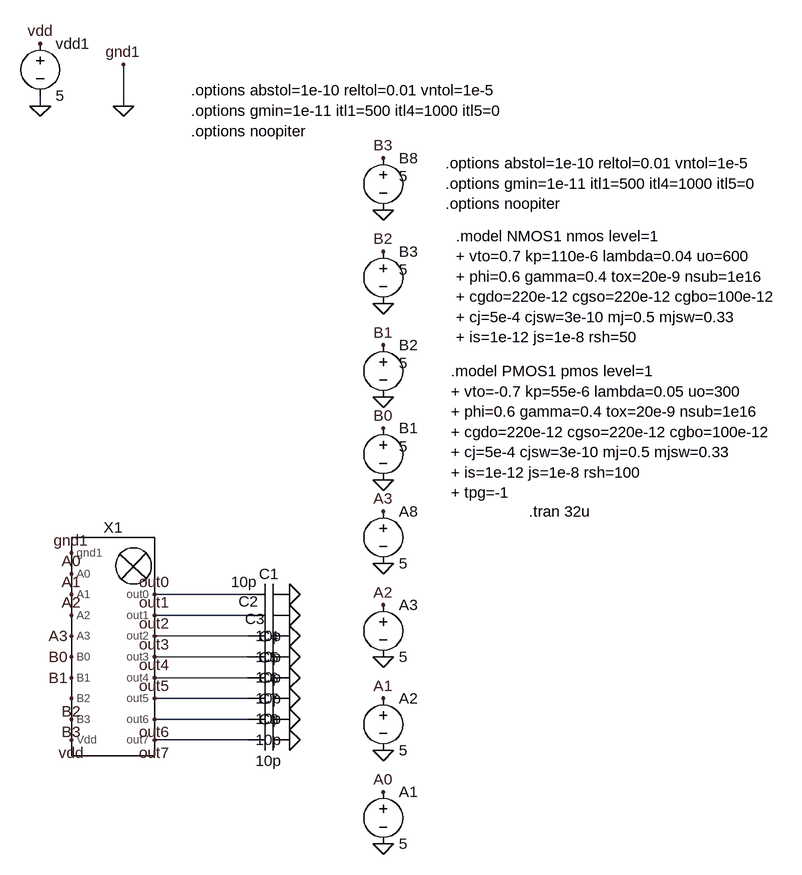
[diagram p0: schematic mult1_tb.asc]
mult1_tb.asc, the LTspice schematic file:
Version 4.1
SHEET 1 1016 740
WIRE -176 -496 -176 -512
WIRE -48 -496 -48 -560
WIRE 144 256 0 256
WIRE 144 288 0 288
WIRE 144 320 0 320
WIRE 144 352 0 352
WIRE 144 384 0 384
WIRE 144 416 0 416
WIRE 144 448 0 448
WIRE 144 480 0 480
FLAG -176 -496 0
FLAG -176 -592 vdd
FLAG -48 -496 0
FLAG -48 -560 gnd1
FLAG -128 192 gnd1
FLAG -128 480 vdd
FLAG -128 224 A0
FLAG -128 256 A1
FLAG -128 288 A2
FLAG -128 320 A3
FLAG -128 352 B0
FLAG -128 384 B1
FLAG -128 416 B2
FLAG -128 448 B3
FLAG 0 256 out0
FLAG 0 288 out1
FLAG 0 320 out2
FLAG 0 352 out3
FLAG 0 384 out4
FLAG 0 416 out5
FLAG 0 448 out6
FLAG 0 480 out7
FLAG 208 256 0
FLAG 208 288 0
FLAG 208 320 0
FLAG 208 352 0
FLAG 208 384 0
FLAG 208 416 0
FLAG 208 448 0
FLAG 208 480 0
FLAG 352 -336 0
FLAG 352 -48 0
FLAG 352 80 0
FLAG 352 208 0
FLAG 352 352 0
FLAG 352 496 0
FLAG 352 640 0
FLAG 352 560 A0
FLAG 352 416 A1
FLAG 352 272 A2
FLAG 352 128 A3
FLAG 352 0 B0
FLAG 352 -128 B1
FLAG 352 -272 B2
FLAG 352 -416 B3
FLAG 352 -192 0
SYMBOL mult1 -64 336 R0
SYMATTR InstName X1
SYMBOL voltage -176 -608 R0
SYMATTR InstName vdd1
SYMATTR Value 5
SYMBOL cap 208 240 R90
WINDOW 0 0 32 VBottom 2
WINDOW 3 -19 70 VTop 2
SYMATTR InstName C1
SYMATTR Value 10p
SYMBOL cap 208 272 R90
WINDOW 0 10 63 VBottom 2
WINDOW 3 32 32 VTop 2
SYMATTR InstName C2
SYMATTR Value 10p
SYMBOL cap 208 304 R90
WINDOW 0 5 53 VBottom 2
WINDOW 3 32 32 VTop 2
SYMATTR InstName C3
SYMATTR Value 10p
SYMBOL cap 208 336 R90
WINDOW 0 0 32 VBottom 2
WINDOW 3 32 32 VTop 2
SYMATTR InstName C4
SYMATTR Value 10p
SYMBOL cap 208 368 R90
WINDOW 0 0 32 VBottom 2
WINDOW 3 32 32 VTop 2
SYMATTR InstName C5
SYMATTR Value 10p
SYMBOL cap 208 400 R90
WINDOW 0 0 32 VBottom 2
WINDOW 3 32 32 VTop 2
SYMATTR InstName C6
SYMATTR Value 10p
SYMBOL cap 208 432 R90
WINDOW 0 0 32 VBottom 2
WINDOW 3 32 32 VTop 2
SYMATTR InstName C7
SYMATTR Value 10p
SYMBOL cap 208 464 R90
WINDOW 0 0 32 VBottom 2
WINDOW 3 32 32 VTop 2
SYMATTR InstName C8
SYMATTR Value 10p
SYMBOL voltage 352 544 R0
WINDOW 123 0 0 Left 0
WINDOW 39 0 0 Left 0
SYMATTR InstName A1
SYMATTR Value 5
SYMBOL voltage 352 400 R0
WINDOW 123 0 0 Left 0
WINDOW 39 0 0 Left 0
SYMATTR InstName A2
SYMATTR Value 5
SYMBOL voltage 352 256 R0
WINDOW 123 0 0 Left 0
WINDOW 39 0 0 Left 0
SYMATTR InstName A3
SYMATTR Value 5
SYMBOL voltage 352 112 R0
WINDOW 123 0 0 Left 0
WINDOW 39 0 0 Left 0
SYMATTR InstName A8
SYMATTR Value 5
SYMBOL voltage 352 -16 R0
WINDOW 3 24 44 Left 2
WINDOW 123 0 0 Left 0
WINDOW 39 0 0 Left 0
SYMATTR Value 5
SYMATTR InstName B1
SYMBOL voltage 352 -144 R0
WINDOW 3 24 44 Left 2
WINDOW 123 0 0 Left 0
WINDOW 39 0 0 Left 0
SYMATTR Value 5
SYMATTR InstName B2
SYMBOL voltage 352 -288 R0
WINDOW 3 24 44 Left 2
WINDOW 123 0 0 Left 0
WINDOW 39 0 0 Left 0
SYMATTR Value 5
SYMATTR InstName B3
SYMBOL voltage 352 -432 R0
WINDOW 3 24 44 Left 2
WINDOW 123 0 0 Left 0
WINDOW 39 0 0 Left 0
SYMATTR Value 5
SYMATTR InstName B8
TEXT 56 -520 Left 2 !.options abstol=1e-10 reltol=0.01 vntol=1e-5\n.options gmin=1e-11 itl1=500 itl4=1000 itl5=0\n.options noopiter
TEXT 464 -296 Left 2 !.model NMOS1 nmos level=1\n+ vto=0.7 kp=110e-6 lambda=0.04 uo=600\n+ phi=0.6 gamma=0.4 tox=20e-9 nsub=1e16\n+ cgdo=220e-12 cgso=220e-12 cgbo=100e-12\n+ cj=5e-4 cjsw=3e-10 mj=0.5 mjsw=0.33\n+ is=1e-12 js=1e-8 rsh=50
TEXT 456 -88 Left 2 !.model PMOS1 pmos level=1\n+ vto=-0.7 kp=55e-6 lambda=0.05 uo=300\n+ phi=0.6 gamma=0.4 tox=20e-9 nsub=1e16\n+ cgdo=220e-12 cgso=220e-12 cgbo=100e-12\n+ cj=5e-4 cjsw=3e-10 mj=0.5 mjsw=0.33\n+ is=1e-12 js=1e-8 rsh=100\n+ tpg=-1
TEXT 576 128 Left 2 !.tran 32u
TEXT 448 -408 Left 2 !.options abstol=1e-10 reltol=0.01 vntol=1e-5\n.options gmin=1e-11 itl1=500 itl4=1000 itl5=0\n.options noopiter

The netlist it stands for:
* mult1_tb.asc
X§X1 A0 A1 A2 A3 B0 B1 B2 B3 0 out0 out1 out2 out3 out4 out5 out6 out7 vdd mult1  ; pins A0 A1 A2 A3 B0 B1 B2 B3 gnd1 out0 out1 out2 out3 out4 out5 out6 out7 Vdd
vdd1 vdd 0 5
C1 0 out0 10p
C2 0 out1 10p
C3 0 out2 10p
C4 0 out3 10p
C5 0 out4 10p
C6 0 out5 10p
C7 0 out6 10p
C8 0 out7 10p
V§A1 A0 0 5
V§A2 A1 0 5
V§A3 A2 0 5
V§A8 A3 0 5
V§B1 B0 0 5
V§B2 B1 0 5
V§B3 B2 0 5
V§B8 B3 0 5
.options abstol=1e-10 reltol=0.01 vntol=1e-5
.options gmin=1e-11 itl1=500 itl4=1000 itl5=0
.options noopiter
.model NMOS1 nmos level=1
+ vto=0.7 kp=110e-6 lambda=0.04 uo=600
+ phi=0.6 gamma=0.4 tox=20e-9 nsub=1e16
+ cgdo=220e-12 cgso=220e-12 cgbo=100e-12
+ cj=5e-4 cjsw=3e-10 mj=0.5 mjsw=0.33
+ is=1e-12 js=1e-8 rsh=50
.model PMOS1 pmos level=1
+ vto=-0.7 kp=55e-6 lambda=0.05 uo=300
+ phi=0.6 gamma=0.4 tox=20e-9 nsub=1e16
+ cgdo=220e-12 cgso=220e-12 cgbo=100e-12
+ cj=5e-4 cjsw=3e-10 mj=0.5 mjsw=0.33
+ is=1e-12 js=1e-8 rsh=100
+ tpg=-1
.tran 32u
.options abstol=1e-10 reltol=0.01 vntol=1e-5
.options gmin=1e-11 itl1=500 itl4=1000 itl5=0
.options noopiter
.backanno
.end